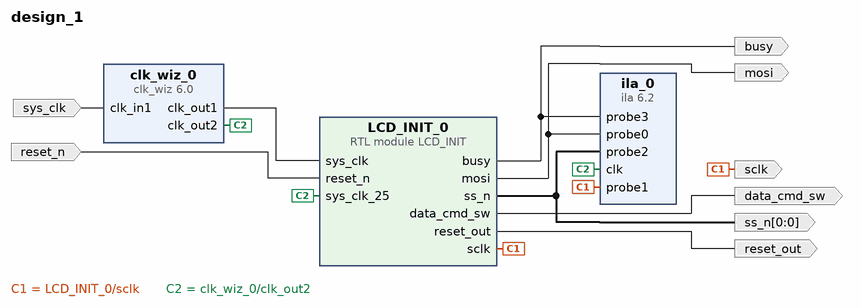
[diagram p0: block diagram of the top level]
# Vivado block design design_1, xc7a100tcsg324-1, Vivado 2021.2
create_bd_design design_1

create_bd_port -dir I -type clk sys_clk
set_property -dict {CONFIG.FREQ_HZ 100000000} [get_bd_ports sys_clk]
create_bd_port -dir O mosi
create_bd_port -dir O sclk
create_bd_port -dir O -from 0 -to 0 ss_n
create_bd_port -dir O busy
create_bd_port -dir O -type rst reset_out
create_bd_port -dir O data_cmd_sw
create_bd_port -dir I -type rst reset_n

create_bd_cell -type ip -vlnv xilinx.com:ip:clk_wiz:6.0 clk_wiz_0
set_property -dict [list \
  CONFIG.CLKOUT2_JITTER 175.402 \
  CONFIG.CLKOUT2_PHASE_ERROR 98.575 \
  CONFIG.CLKOUT2_REQUESTED_OUT_FREQ 25.000 \
  CONFIG.CLKOUT2_USED true \
  CONFIG.MMCM_CLKOUT1_DIVIDE 40 \
  CONFIG.NUM_OUT_CLKS 2 \
  CONFIG.USE_RESET false \
] [get_bd_cells clk_wiz_0]
create_bd_cell -type ip -vlnv xilinx.com:ip:ila:6.2 ila_0
set_property -dict [list \
  CONFIG.C_DATA_DEPTH 32768 \
  CONFIG.C_ENABLE_ILA_AXI_MON false \
  CONFIG.C_MONITOR_TYPE Native \
  CONFIG.C_NUM_OF_PROBES 4 \
] [get_bd_cells ila_0]
create_bd_cell -type module -reference LCD_INIT LCD_INIT_0

# ---- connections ----

connect_bd_net [get_bd_pins LCD_INIT_0/busy] [get_bd_ports busy] [get_bd_pins ila_0/probe3]
connect_bd_net [get_bd_pins LCD_INIT_0/data_cmd_sw] [get_bd_ports data_cmd_sw]
connect_bd_net [get_bd_pins LCD_INIT_0/mosi] [get_bd_ports mosi] [get_bd_pins ila_0/probe0]
connect_bd_net [get_bd_pins LCD_INIT_0/reset_out] [get_bd_ports reset_out]
connect_bd_net [get_bd_pins LCD_INIT_0/sclk] [get_bd_ports sclk] [get_bd_pins ila_0/probe1]
connect_bd_net [get_bd_pins LCD_INIT_0/ss_n] [get_bd_ports ss_n] [get_bd_pins ila_0/probe2]
connect_bd_net -net clk_100MHz_1 [get_bd_ports sys_clk] [get_bd_pins clk_wiz_0/clk_in1]
connect_bd_net [get_bd_pins clk_wiz_0/clk_out1] [get_bd_pins LCD_INIT_0/sys_clk]
connect_bd_net [get_bd_pins clk_wiz_0/clk_out2] [get_bd_pins ila_0/clk] [get_bd_pins LCD_INIT_0/sys_clk_25]
connect_bd_net -net reset_n_0_1 [get_bd_ports reset_n] [get_bd_pins LCD_INIT_0/reset_n]

validate_bd_design
save_bd_design
